# Altium schematic sheet SoC_MII.SchDoc
size A4; SheetNumber: 20; SheetTotal: 22
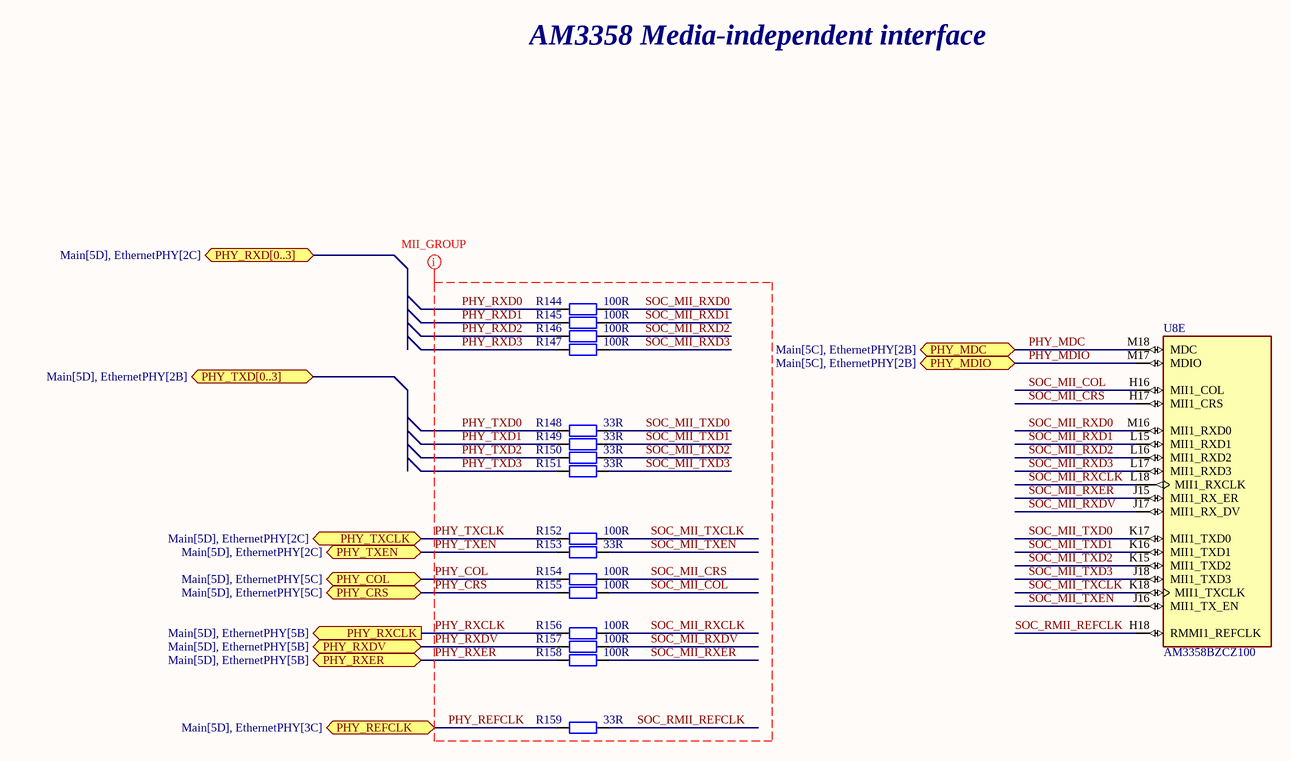
[diagram p0: SoC_MII.SchDoc]

## Parts
R144  100R  [R_0402]
R145  100R  [R_0402]
R146  100R  [R_0402]
R147  100R  [R_0402]
R148  33R  [R_0402]
R149  33R  [R_0402]
R150  33R  [R_0402]
R151  33R  [R_0402]
R152  100R  [R_0402]
R153  33R  [R_0402]
R154  100R  [R_0402]
R155  100R  [R_0402]
R156  100R  [R_0402]
R157  100R  [R_0402]
R158  100R  [R_0402]
R159  33R  [R_0402]
U8  AM3358BZCZ100  [BGA324C80P18X18_1500X1500X140]  (part E of 9)

## Ports
PHY_COL (bidir, see Main[5D], EthernetPHY[5C]), PHY_CRS (bidir, see Main[5D], EthernetPHY[5C]), PHY_MDC (bidir, see Main[5C], EthernetPHY[2B]), PHY_MDIO (bidir, see Main[5C], EthernetPHY[2B]), PHY_REFCLK (bidir, see Main[5D], EthernetPHY[3C]), PHY_RXCLK (out, see Main[5D], EthernetPHY[5B]), PHY_RXD[0..3] (bidir, see Main[5D], EthernetPHY[2C]), PHY_RXDV (bidir, see Main[5D], EthernetPHY[5B]), PHY_RXER (bidir, see Main[5D], EthernetPHY[5B]), PHY_TXCLK (bidir, see Main[5D], EthernetPHY[2C]), PHY_TXD[0..3] (bidir, see Main[5D], EthernetPHY[2B]), PHY_TXEN (bidir, see Main[5D], EthernetPHY[2C])

## Nets
PHY_COL: R154.1 ; port PHY_COL
PHY_CRS: R155.1 ; port PHY_CRS
PHY_MDC: U8.M18(MDC) ; port PHY_MDC
PHY_MDIO: U8.M17(MDIO) ; port PHY_MDIO
PHY_REFCLK: R159.1 ; port PHY_REFCLK
PHY_RXCLK: R156.1 ; port PHY_RXCLK
PHY_RXD0: R144.1
PHY_RXD1: R145.1
PHY_RXD2: R146.1
PHY_RXD3: R147.1
PHY_RXDV: R157.1 ; port PHY_RXDV
PHY_RXER: R158.1 ; port PHY_RXER
PHY_TXCLK: R152.1 ; port PHY_TXCLK
PHY_TXD0: R148.1
PHY_TXD1: R149.1
PHY_TXD2: R150.1
PHY_TXD3: R151.1
PHY_TXEN: R153.1 ; port PHY_TXEN
SOC_MII_COL: R155.2 U8.H16(MII1_COL)
SOC_MII_CRS: R154.2 U8.H17(MII1_CRS)
SOC_MII_RXCLK: R156.2 U8.L18(MII1_RXCLK)
SOC_MII_RXD0: R144.2 U8.M16(MII1_RXD0)
SOC_MII_RXD1: R145.2 U8.L15(MII1_RXD1)
SOC_MII_RXD2: R146.2 U8.L16(MII1_RXD2)
SOC_MII_RXD3: R147.2 U8.L17(MII1_RXD3)
SOC_MII_RXDV: R157.2 U8.J17(MII1_RX_DV)
SOC_MII_RXER: R158.2 U8.J15(MII1_RX_ER)
SOC_MII_TXCLK: R152.2 U8.K18(MII1_TXCLK)
SOC_MII_TXD0: R148.2 U8.K17(MII1_TXD0)
SOC_MII_TXD1: R149.2 U8.K16(MII1_TXD1)
SOC_MII_TXD2: R150.2 U8.K15(MII1_TXD2)
SOC_MII_TXD3: R151.2 U8.J18(MII1_TXD3)
SOC_MII_TXEN: R153.2 U8.J16(MII1_TX_EN)
SOC_RMII_REFCLK: R159.2 U8.H18(RMMI1_REFCLK)

## Layout directives
net class MII_GROUP: PHY_COL, PHY_CRS, PHY_REFCLK, PHY_RXCLK, PHY_RXD0, PHY_RXD1, PHY_RXD2, PHY_RXD3, PHY_RXDV, PHY_RXER, PHY_TXCLK, PHY_TXD0, PHY_TXD1, PHY_TXD2, PHY_TXD3, PHY_TXEN, SOC_MII_COL, SOC_MII_CRS, SOC_MII_RXCLK, SOC_MII_RXD0, SOC_MII_RXD1, SOC_MII_RXD2, SOC_MII_RXD3, SOC_MII_RXDV, SOC_MII_RXER, SOC_MII_TXCLK, SOC_MII_TXD0, SOC_MII_TXD1, SOC_MII_TXD2, SOC_MII_TXD3, SOC_MII_TXEN, SOC_RMII_REFCLK

## Notes on the sheet
- AM3358 Media-independent interface

## Library data of the parts
R144-R159 = R_0402: Resistor 0402 SMD
U8 = AM3358BZCZ100: ARM-ASeries 1GHz NFBGA-324 Microcontrollers (MCU/MPU/SOC) ROHS; Manufacturer: Texas Instruments; Manufacturer Part Number: AM3358BZCZ100; Datasheet Link: https://www.ti.com/lit/ds/symlink/am3358.pdf